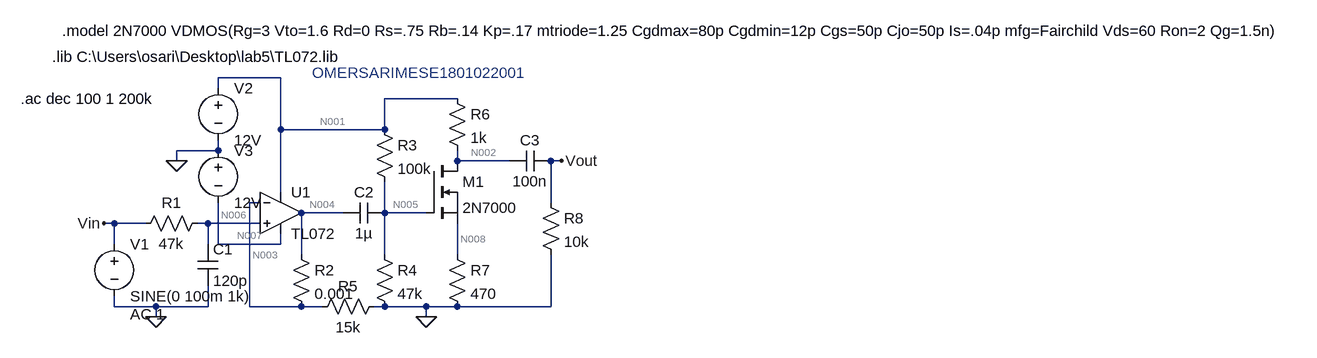
[diagram p0: schematic Lab5.asc]
Lab5.asc, the LTspice schematic file:
Version 4
SHEET 1 1892 680
WIRE 160 -48 64 -48
WIRE 64 -32 64 -48
WIRE 432 -16 320 -16
WIRE 160 32 160 -48
WIRE 320 32 320 -16
WIRE 320 32 160 32
WIRE 64 64 64 48
WIRE 64 64 0 64
WIRE 0 80 0 64
WIRE 432 80 432 64
WIRE 512 80 432 80
WIRE 592 80 576 80
WIRE 160 128 160 32
WIRE 128 144 112 144
WIRE 576 144 576 80
WIRE 256 160 192 160
WIRE 320 160 320 112
WIRE 384 160 320 160
WIRE -96 176 -112 176
WIRE -48 176 -96 176
WIRE 48 176 32 176
WIRE 128 176 48 176
WIRE -96 208 -96 176
WIRE 48 208 48 176
WIRE 64 208 64 144
WIRE 160 208 160 192
WIRE 160 208 64 208
WIRE 192 224 192 160
WIRE 320 224 320 160
WIRE 432 224 432 176
WIRE -96 304 -96 288
WIRE -32 304 -96 304
WIRE 48 304 48 272
WIRE 48 304 -32 304
WIRE 112 304 112 144
WIRE 192 304 112 304
WIRE 224 304 192 304
WIRE 320 304 304 304
WIRE 384 304 320 304
WIRE 432 304 384 304
WIRE 576 304 576 224
WIRE 576 304 432 304
WIRE -32 320 -32 304
WIRE 384 320 384 304
FLAG -32 320 0
FLAG 384 320 0
FLAG 0 80 0
FLAG 592 80 Vout
FLAG -112 176 Vin
SYMBOL OpAmps\\opamp2 160 96 R0
SYMATTR InstName U1
SYMATTR Value TL072
SYMBOL res 48 160 R90
WINDOW 0 0 56 VBottom 2
WINDOW 3 32 56 VTop 2
SYMATTR InstName R1
SYMATTR Value 47k
SYMBOL cap 32 208 R0
SYMATTR InstName C1
SYMATTR Value 120p
SYMBOL voltage -96 192 R0
WINDOW 123 24 124 Left 2
WINDOW 39 0 0 Left 0
SYMATTR InstName V1
SYMATTR Value SINE(0 100m 1k)
SYMATTR Value2 AC 1
SYMBOL cap 320 144 R90
WINDOW 0 0 32 VBottom 2
WINDOW 3 32 32 VTop 2
SYMATTR InstName C2
SYMATTR Value 1µ
SYMBOL res 176 208 R0
SYMATTR InstName R2
SYMATTR Value 0.001
SYMBOL res 304 16 R0
SYMATTR InstName R3
SYMATTR Value 100k
SYMBOL nmos 384 80 R0
SYMATTR InstName M1
SYMATTR Value 2N7000
SYMBOL res 304 208 R0
SYMATTR InstName R4
SYMATTR Value 47k
SYMBOL res 320 288 R90
WINDOW 0 0 56 VBottom 2
WINDOW 3 32 56 VTop 2
SYMATTR InstName R5
SYMATTR Value 15k
SYMBOL res 416 -32 R0
SYMATTR InstName R6
SYMATTR Value 1k
SYMBOL res 416 208 R0
SYMATTR InstName R7
SYMATTR Value 470
SYMBOL cap 576 64 R90
WINDOW 0 0 32 VBottom 2
WINDOW 3 32 32 VTop 2
SYMATTR InstName C3
SYMATTR Value 100n
SYMBOL res 560 128 R0
SYMATTR InstName R8
SYMATTR Value 10k
SYMBOL voltage 64 -48 R0
WINDOW 123 0 0 Left 0
WINDOW 39 0 0 Left 0
SYMATTR InstName V2
SYMATTR Value 12V
SYMBOL voltage 64 48 R0
WINDOW 123 0 0 Left 0
WINDOW 39 0 0 Left 0
SYMATTR InstName V3
SYMATTR Value 12V
TEXT -176 -120 Left 2 !.model 2N7000 VDMOS(Rg=3 Vto=1.6 Rd=0 Rs=.75 Rb=.14 Kp=.17 mtriode=1.25 Cgdmax=80p Cgdmin=12p Cgs=50p Cjo=50p Is=.04p mfg=Fairchild Vds=60 Ron=2 Qg=1.5n)
TEXT -192 -80 Left 2 !.lib C:\\Users\\osari\\Desktop\\lab5\\TL072.lib
TEXT 208 -56 Left 2 ;OMERSARIMESE1801022001
TEXT -240 -16 Left 2 !.ac dec 100 1 200k

The netlist it stands for:
* Lab5.asc
XU1 N006 N003 N001 N007 N004 TL072  ; pins In+ In- V+ V- OUT
R1 N006 Vin 47k
C1 N006 0 120p
V1 Vin 0 SINE(0 100m 1k) AC 1
C2 N005 N004 1µ
R2 N004 N003 0.001
R3 N001 N005 100k
M1 N002 N005 N008 N008 2N7000
R4 N005 0 47k
R5 0 N003 15k
R6 N001 N002 1k
R7 N008 0 470
C3 Vout N002 100n
R8 Vout 0 10k
V2 N001 0 12V
V3 0 N007 12V
.model NMOS NMOS
.model PMOS PMOS
.lib standard.mos
.model 2N7000 VDMOS(Rg=3 Vto=1.6 Rd=0 Rs=.75 Rb=.14 Kp=.17 mtriode=1.25 Cgdmax=80p Cgdmin=12p Cgs=50p Cjo=50p Is=.04p mfg=Fairchild Vds=60 Ron=2 Qg=1.5n)
.lib C:\Users\osari\Desktop\lab5\TL072.lib
* OMERSARIMESE1801022001
.ac dec 100 1 200k
.backanno
.end

* Results of the author's LTspice run, read from the files saved beside the schematic
* Operating Point, zero values left out:
*   V(n004) = 8.994 µV
*   V(n007) = -12 V
*   V(n001) = 12 V
*   V(n003) = 8.994 µV
*   V(n006) = -1.976 µV
*   V(n005) = 3.837 V
*   V(n002) = 7.725 V
*   V(n008) = 2.009 V
*   Id(M1) = 4.275 mA
*   Ig(M1) = -18.66 pA
*   Is(M1) = -4.275 mA
*   I(R7) = 4.275 mA
*   I(R6) = 4.275 mA
*   I(R5) = -599.6 pA
*   I(R4) = 81.63 µA
*   I(R3) = 81.63 µA
*   I(R2) = 641.7 pA
*   I(R1) = -42.05 pA
*   I(V3) = -11.39 mA
*   I(V2) = -15.75 mA
*   I(V1) = -42.05 pA
*   Ix(u1:1) = 42.05 pA
*   Ix(u1:2) = 42.05 pA
*   Ix(u1:3) = 11.39 mA
*   Ix(u1:4) = -11.39 mA
*   Ix(u1:5) = -641.7 pA
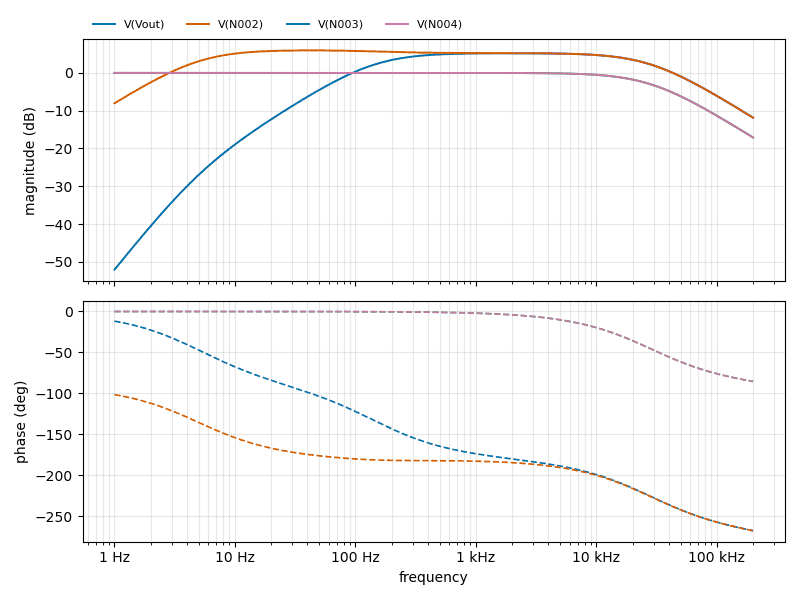
[diagram p1: AC Analysis of Lab5.asc, plotted from the saved traces]
* AC Analysis, 1 run:
*   V(Vout): -52.08 dB at 1 Hz, -11.85 dB at 200 kHz, peak 5.20 dB at 2.042 kHz, 3 dB below the peak at 143.4 Hz and 28.51 kHz
*   V(N002): -8.04 dB at 1 Hz, -11.85 dB at 200 kHz, peak 5.95 dB at 42.66 Hz, 3 dB below the peak at 4.846 Hz and 23.59 kHz
*   V(N003): -0.00 dB at 1 Hz, -17.09 dB at 200 kHz, peak -0.00 dB at 1 Hz, 3 dB below the peak at 28.22 kHz
*   V(N004): -0.00 dB at 1 Hz, -17.09 dB at 200 kHz, peak -0.00 dB at 1 Hz, 3 dB below the peak at 28.22 kHz